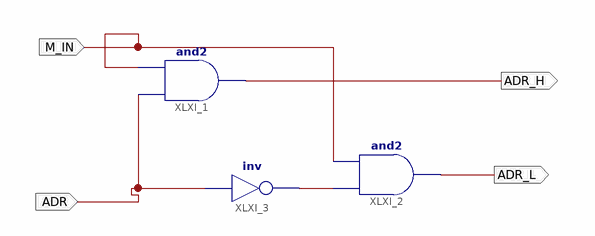
[diagram p0: schematic sheet 1]
// Xilinx ISE schematic adrdec2.sch (spartan3e) as structural Verilog: 3 symbols, 4 ports
module adrdec2 (
  input  M_IN,
  input  ADR,
  output ADR_H,
  output ADR_L
);

  wire XLXN_4;

  and XLXI_1 (ADR_H, ADR, M_IN);
  and XLXI_2 (ADR_L, XLXN_4, M_IN);
  not XLXI_3 (XLXN_4, ADR);
endmodule
